# Altium schematic sheet Sheet2.SchDoc
size A; SheetNumber: 3; SheetTotal: 3
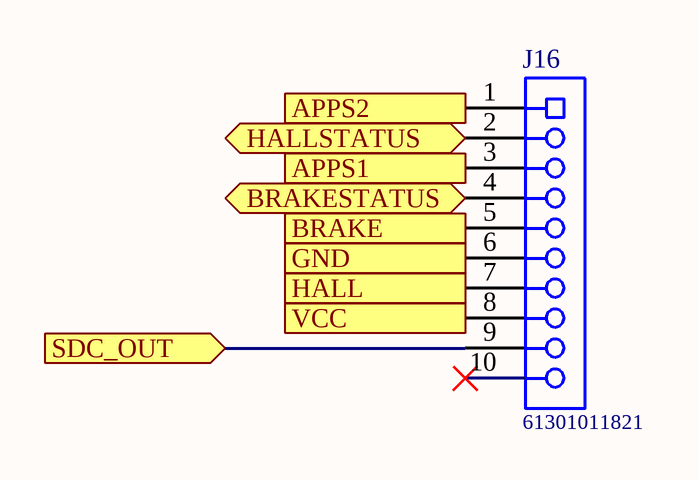
[diagram p0: Sheet2.SchDoc]

## Parts
J16  61301011821  [61301011821]

## Ports
APPS1 (out), APPS2 (out), BRAKE (out), BRAKESTATUS (bidir), GND (out), HALL (out), HALLSTATUS (bidir), SDC_OUT (in), VCC (out)

## Nets
APPS1: J16.3 ; port APPS1
APPS2: J16.1 ; port APPS2
BRAKE: J16.5 ; port BRAKE
BRAKESTATUS: J16.4 ; port BRAKESTATUS
GND: J16.6 ; port GND
HALL: J16.7 ; port HALL
HALLSTATUS: J16.2 ; port HALLSTATUS
SDC_OUT: J16.9 ; port SDC_OUT
VCC: J16.8 ; port VCC

Not connected (* = marked no-connect by the designer): J16 10*

## Library data of the parts
J16 = CMP-1502-01332-1: THT Vertical Socket Header WR-PHD, Pitch 2.54 mm, Single Row, 10 pins; Manufacturer: Wurth Elektronik; Rated Current: 3A; Working Voltage: 250VAC; Gender: Female; Pitch: 2.54mm; Contact Resistance: 20mOhm; Pin Number: 10; Withstanding Voltage: 500VAC; Publisher: WurthElektronik; Orientation: Vertical; Row Number: Single; Package Reference: 61301011821; Packaging: Tray; Datasheet URL: https://katalog.we-online.de/em/datasheet/6130xx11821.pdf; Operating Temperature: -40to125degC; Part Number: 61301011821; Manufacturer URL: http://www.we-online.de; Mounting Technology: THT